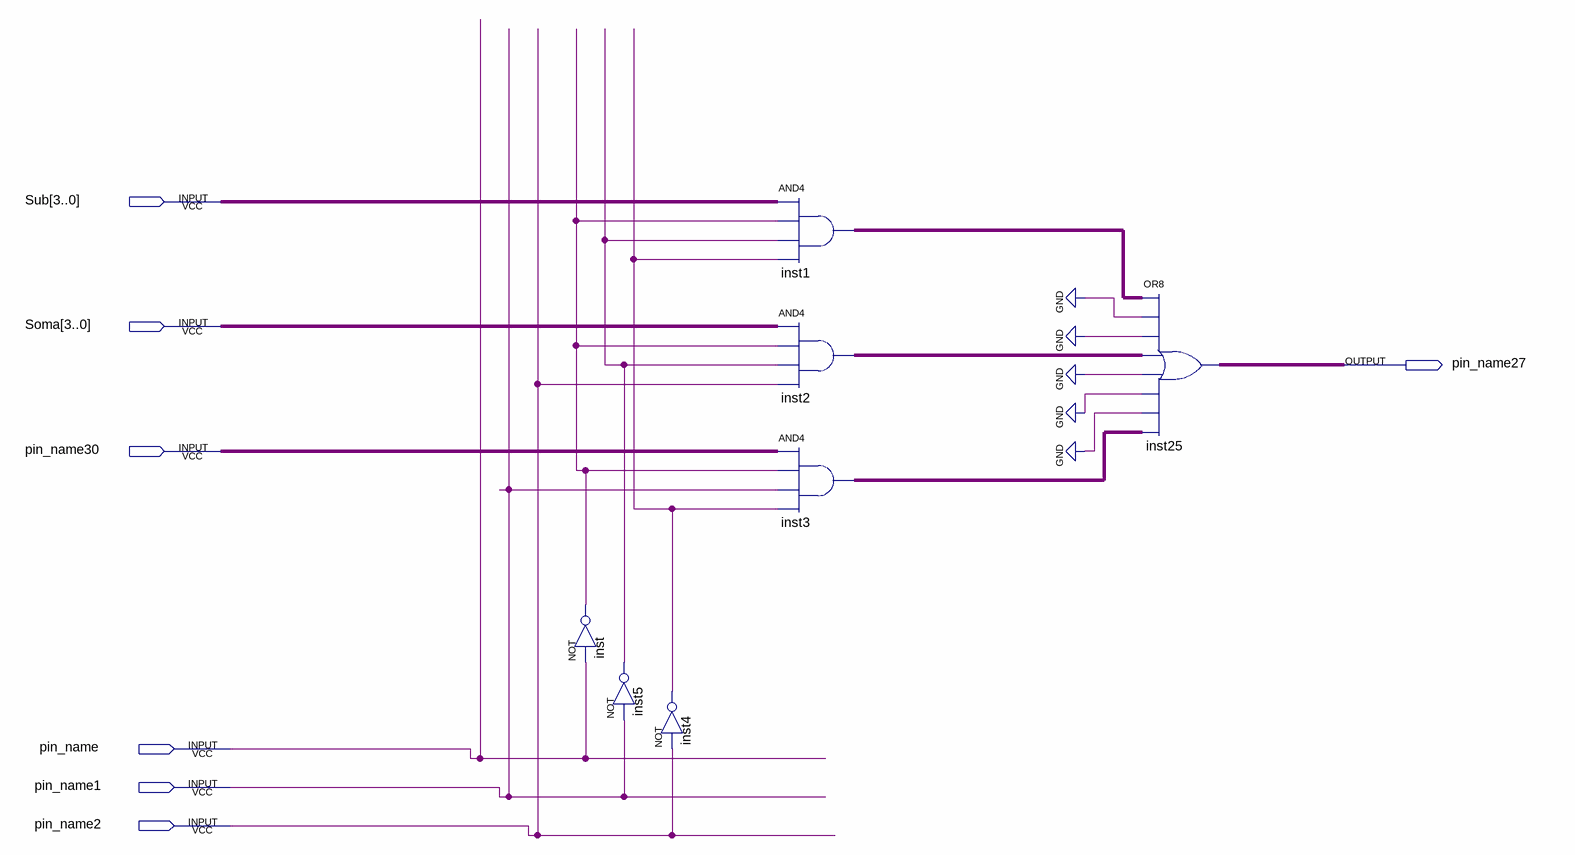
[diagram p0: schematic sheet]
// Quartus schematic MUX.bdf as structural Verilog: 7 symbols, 7 pins
module MUX (
  input  [3:0] Sub,
  input  [3:0] Soma,
  input  pin_name30,
  input  pin_name,
  input  pin_name1,
  input  pin_name2,
  output pin_name27
);

  wire inst4_out, inst5_out, inst_out;
  wire [3:0] inst1_out, inst2_out, inst3_out, inst25_out, undriven;

  not inst (inst_out, pin_name);
  not inst5 (inst5_out, pin_name1);
  not inst4 (inst4_out, pin_name2);
  assign inst1_out = Sub & {4{inst_out}} & {4{inst5_out}} & {4{inst4_out}};  // AND4 inst1, 4 bits wide
  assign inst2_out = Soma & {4{inst_out}} & {4{inst5_out}} & {4{pin_name2}};  // AND4 inst2, 4 bits wide
  assign inst3_out = undriven & {4{inst_out}} & {4{pin_name1}} & {4{inst4_out}};  // AND4 inst3, 4 bits wide
  assign inst25_out = inst1_out | 4'b0000 | 4'b0000 | inst2_out | 4'b0000 | 4'b0000 | 4'b0000 | inst3_out;  // OR8 inst25, 4 bits wide
endmodule
